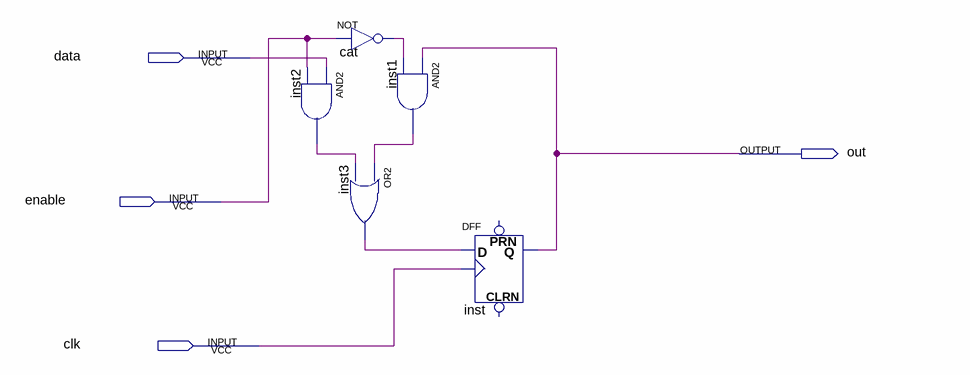
[diagram p0: schematic sheet]
// Quartus schematic dataMod.bdf as structural Verilog: 5 symbols, 4 pins
module dataMod (
  input  data,
  input  enable,
  input  clk,
  output out
);

  wire cat_out, inst1_out, inst2_out, inst3_out;

  not cat (cat_out, enable);
  and inst2 (inst2_out, data, enable);
  or inst3 (inst3_out, inst1_out, inst2_out);
  and inst1 (inst1_out, out, cat_out);
  DFF inst (.CLK(clk), .D(inst3_out), .Q(out));  // open: CLRN, PRN
endmodule
